# EAGLE design top (EAGLE 9.5.2)
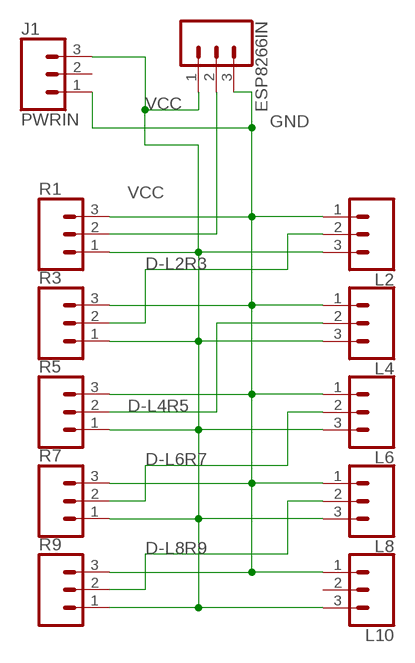
[diagram p0: schematic, sheet 1]

## Parts
ESP8266IN  CONN_03  [1X03]
J1  PWRIN  CONN_03  [1X03]
L2  CONN_03  [1X03]
L4  CONN_03  [1X03]
L6  CONN_03  [1X03]
L8  CONN_03  [1X03]
L10  CONN_03  [1X03]
R1  CONN_03  [1X03]
R3  CONN_03  [1X03]
R5  CONN_03  [1X03]
R7  CONN_03  [1X03]
R9  CONN_03  [1X03]

## Nets
D-INR1 [DATA]: ESP8266IN.2 R1.2
D-L2R3 [DATA]: L2.2 R3.2
D-L4R5 [DATA]: L4.2 R5.2
D-L6R7 [DATA]: L6.2 R7.2
D-L8R9 [DATA]: L8.2 R9.2
GND [PWR]: ESP8266IN.3 J1.1 L2.1 L4.1 L6.1 L8.1 L10.1 R1.3 R3.3 R5.3 R7.3 R9.3
VCC [PWR]: ESP8266IN.1 J1.3 L2.3 L4.3 L6.3 L8.3 L10.3 R1.1 R3.1 R5.1 R7.1 R9.1
Unconnected: J1.2 L10.2

## Library data of the parts
ESP8266IN J1 = SparkFun-Connectors:CONN_03: Multi connection point. Often used as Generic Header-pin footprint for 0.1 inch spaced/style header connections On any of the 0.1 inch spaced packages, you can populate with these: Break Away Headers - Straight <https://www.sparkfun.com/products/116> (PRT-00116) Break Away Male Headers - Right Angle <https://www.sparkfun.com/products/553> (PRT-00553) Female Headers <https://www.sparkfun.com/products/115> (PRT-00115) Break Away Headers - Machine Pin <https://www.sparkfun.com/products/117> (PRT-00117) Break Away Female Headers - Swiss Machine Pin <https://www.sparkfun.com/products/743> (PRT-00743) Stackable Header - 3 Pin (Female, 0.1") <https://www.sparkfun.com/products/13875> (PRT-13875) For SCREWTERMINALS and SPRING TERMINALS visit here: Screw Terimnals on SparkFun.com <https://www.sparkfun.com/search/results?term=Screw+Terminals> (5mm/3.5mm/2.54mm spacing) This device is also useful as a general connection point to wire up your design to another part of your project. Our various solder wires solder well into these plated through hole pads. Hook-Up Wire - Assortment (Stranded, 22 AWG) <https://www.sparkfun.com/products/11375> (PRT-11375) Hook-Up Wire - Assortment (Solid Core, 22 AWG) <https://www.sparkfun.com/products/11367> (PRT-11367) View the entire wire category on our website here <https://www.sparkfun.com/categories/141> Special notes: Molex polarized connector foot print use with SKU : PRT-08232 with associated crimp pins and housings.; PROD_ID: XXX-00000; VALUE: 455-1750-1-ND
L2 L4 L6 L8 L10 R1 R3 R5 R7 R9 = SparkFun-Connectors:CONN_03: Multi connection point. Often used as Generic Header-pin footprint for 0.1 inch spaced/style header connections On any of the 0.1 inch spaced packages, you can populate with these: Break Away Headers - Straight <https://www.sparkfun.com/products/116> (PRT-00116) Break Away Male Headers - Right Angle <https://www.sparkfun.com/products/553> (PRT-00553) Female Headers <https://www.sparkfun.com/products/115> (PRT-00115) Break Away Headers - Machine Pin <https://www.sparkfun.com/products/117> (PRT-00117) Break Away Female Headers - Swiss Machine Pin <https://www.sparkfun.com/products/743> (PRT-00743) Stackable Header - 3 Pin (Female, 0.1") <https://www.sparkfun.com/products/13875> (PRT-13875) For SCREWTERMINALS and SPRING TERMINALS visit here: Screw Terimnals on SparkFun.com <https://www.sparkfun.com/search/results?term=Screw+Terminals> (5mm/3.5mm/2.54mm spacing) This device is also useful as a general connection point to wire up your design to another part of your project. Our various solder wires solder well into these plated through hole pads. Hook-Up Wire - Assortment (Stranded, 22 AWG) <https://www.sparkfun.com/products/11375> (PRT-11375) Hook-Up Wire - Assortment (Solid Core, 22 AWG) <https://www.sparkfun.com/products/11367> (PRT-11367) View the entire wire category on our website here <https://www.sparkfun.com/categories/141> Special notes: Molex polarized connector foot print use with SKU : PRT-08232 with associated crimp pins and housings.

## Net classes
1 PWR: width 1 mm
3 DATA: width 0.75 mm

## Board
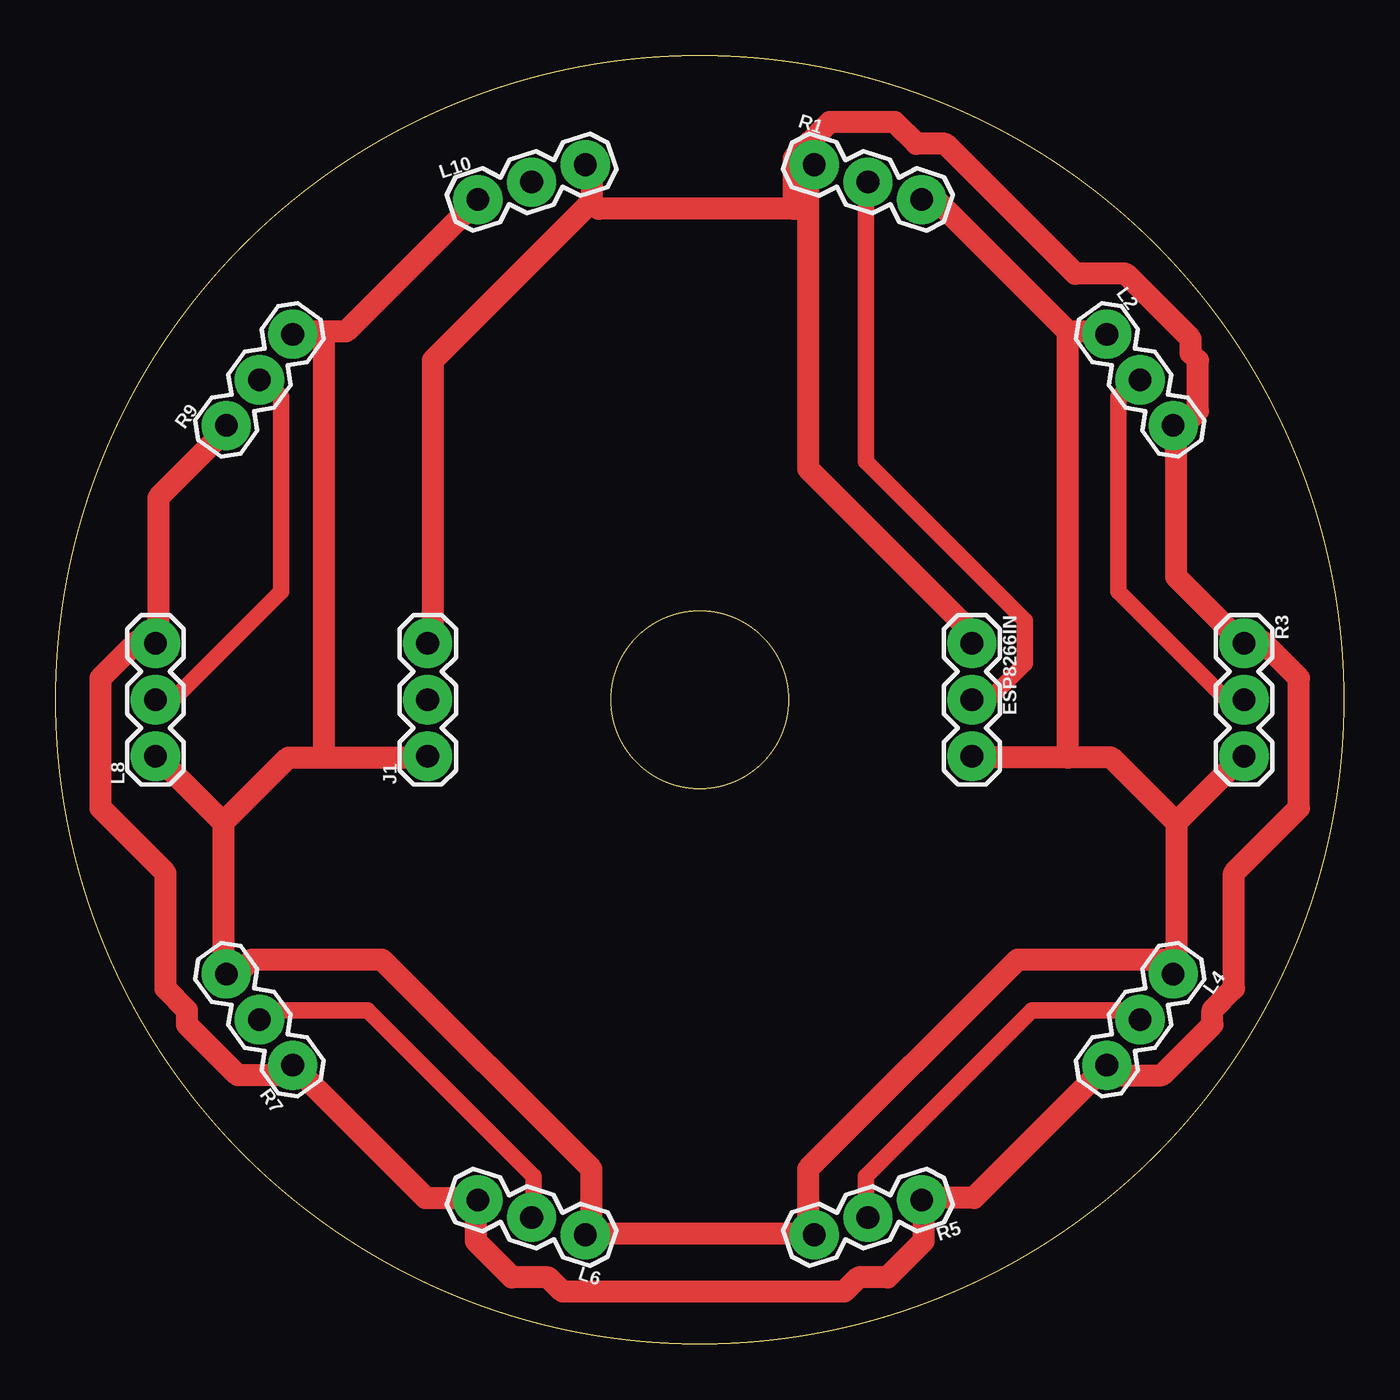
[diagram p1: board, top side]

Size 58 x 58 mm. Coordinates in mm from the lower left corner, seen from the top.
Outline: circle at 29,29 radius 29
Outline: circle at 29,29 radius 4
Copper layers 1: Top 0.035mm
Design rules "default *": minimum track width 0.3mm, minimum drill 1mm, track to track 1mm, track to pad 0.75mm, pad to pad 0.25mm, via to via 0.25mm, smd to smd 0.05mm, copper to edge 40mil, drill to drill 6mil, minimum pad ring 0.6mm, minimum via ring 8mil, stop-mask expansion 4mil, vias tented up to drill 0mil, thermal gap 10mil

### Footprints (pad centres in the part's own frame; a part is rotated, then mirrored left to right if it is on the bottom)
1X03 = drill 1.016 pad 1.88: 1 0,0; 2 2.54,0; 3 5.08,0

### Placement (x,y rotation side)
ESP8266IN  41.25,31.54 270 top
J1  16.75,26.46 90 top
L2  47.33,45.46 306 top
L4  50.31,16.65 234 top
L6  23.84,4.91 162 top
L8  4.5,26.46 90 top
L10  19.01,51.52 18 top
R1  34.16,53.09 342 top
R3  53.5,31.54 270 top
R5  38.99,6.48 198 top
R7  10.67,12.54 126 top
R9  7.69,41.35 54 top

### Tracks (layer width: path | path; a pad name or v marks a point on that pad's centre or on a via)
D-INR1
  Top 0.75: ESP8266IN.2 42,29 43.62,30.62 43.62,32.58 36.48,39.73 36.48,52.08 R1.2
D-L2R3
  Top 0.75: R3.2 52.73,29 47.85,33.88 47.85,42.65 48.5,43.3 L2.2
D-L4R5
  Top 0.75: R5.2 36.48,5.93 36.48,7.55 43.95,15.03 48.17,15.03 48.5,14.7 L4.2
D-L6R7
  Top 0.75: L6.2 21.52,5.93 21.52,7.55 14.05,15.03 9.82,15.03 9.5,14.7 R7.2
D-L8R9
  Top 0.75: L8.2 5.27,29 10.15,33.88 10.15,42.65 9.5,43.3 R9.2
GND
  Top 1: 12.1,45.58 13.07,45.58 18.93,51.42 L10.1 | 12.1,45.58 10.8,45.58 R9.3 | 7.55,23.48 7.55,16.98 R7.3 7.88,16.98 8.52,16.98 8.85,17.3 14.7,17.3 24.12,7.88 24.12,5.27 L6.1 24.12,4.95 33.88,4.95 R5.3 33.88,5.27 33.88,7.88 43.3,17.3 50.12,17.3 L4.1 50.45,16.98 50.45,23.48 | 7.55,23.48 4.62,26.4 L8.1 | 12.1,26.4 10.48,26.4 7.55,23.48 | 12.1,26.4 16.65,26.4 J1.1 | 12.1,26.4 12.1,45.58 | 45.58,45.58 39.73,51.42 39.08,51.42 R1.3 | 45.58,45.58 47.2,45.58 L2.1 | 50.45,23.48 53.38,26.4 R3.3 | 45.58,26.4 47.52,26.4 50.45,23.48 | 45.58,26.4 41.35,26.4 ESP8266IN.3 | 45.58,26.4 45.58,45.58
VCC
  Top 1: R9.1 7.55,41.02 4.62,38.1 4.62,31.6 L8.3 4.3,31.6 3.65,31.6 2.02,29.98 2.02,24.12 4.95,21.2 4.95,16 5.93,15.03 5.93,14.38 8.2,12.1 10.48,12.1 R7.1 10.8,12.43 16.65,6.57 18.93,6.57 L6.3 18.93,6.25 18.93,4.62 20.55,3 22.18,3 22.82,2.35 35.5,2.35 36.15,3 37.45,3 39.08,4.62 39.08,6.25 R5.1 39.08,6.57 41.35,6.57 47.2,12.43 L4.3 47.52,12.1 49.8,12.1 52.08,14.38 52.08,15.03 53.05,16 53.05,21.2 55.98,24.12 55.98,29.98 54.35,31.6 53.7,31.6 R3.1 53.38,31.6 50.45,34.52 50.45,41.02 L2.3 50.77,41.35 51.42,42 51.42,44.27 51.1,44.6 51.1,45.25 48.17,48.17 45.9,48.17 40.05,54.02 38.75,54.02 37.77,55 34.85,55 33.23,53.38 33.23,51.1 | 24.12,51.42 16.98,44.27 16.98,31.6 J1.3 | 24.12,51.42 24.12,53.05 L10.3 | 33.88,51.1 33.88,53.05 R1.1 | 33.88,51.1 33.88,39.4 41.02,32.25 41.02,31.6 ESP8266IN.1 | 33.23,51.1 24.45,51.1 24.12,51.42 | 33.23,51.1 33.88,51.1